# Altium project Power Distribution Board.PrjPcb (part 1 of 2)
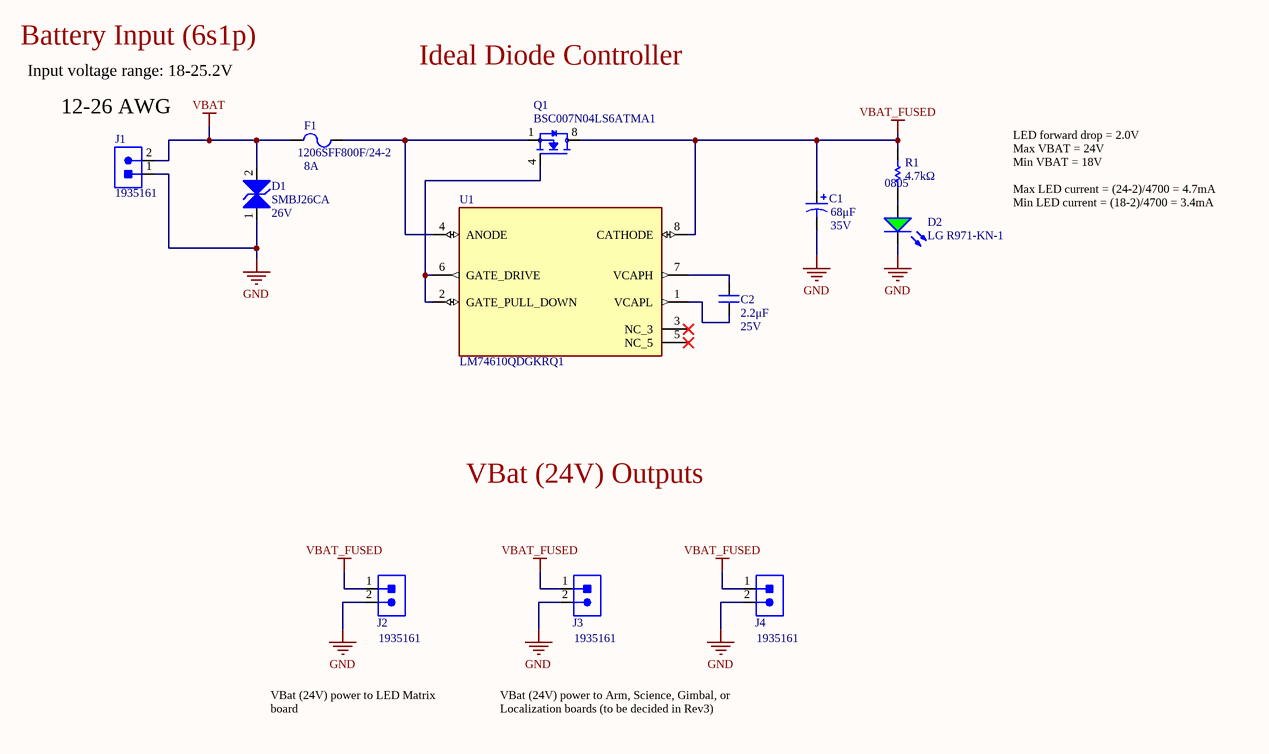
[diagram p0: SH1 - POWER.SchDoc]
10 sheets, 250 parts. Net scope: flat (ports and power ports of the same name join across sheets).
Board file: Power Distribution Board.PcbDoc
Sheets:
  SH1 - POWER.SchDoc
  SH2 - 24V BUCK-BOOST CONVERTER.SchDoc
  SH3 - 17V BUCK CONVERTER.SchDoc
  SH4 - 5V VICOR DCDC.SchDoc
  SH5 - 3.3V LINEAR REGULATOR.SchDoc
  SH6 - LOAD MONITORING 1.SchDoc
  SH7 - LOAD MONITORING 2.SchDoc
  SH8 - MICROCONTROLLER.SchDoc
  SH9 - CAN.SchDoc
  SH10 - RS-485.SchDoc

## Sheet SH1 - POWER.SchDoc: Power
size B; CheckedBy: Lance Bantoto; Engineer: Cindy Li; Organization: UW Robotics; Address1: 200 University Avenue; Address2: Waterloo; Address3: Ontario; Address4: Canada N2L 3G6; DocumentNumber: 1; Revision: 2; SheetNumber: 1; SheetTotal: 10

### Parts
C1  value 68μF  Voltage Rating: 35V  [RADIAL_NICHION_1V]  (hidden comment: CAP_68uF_35V_ALUM)
C2  value 2.2μF  Voltage Rating: 25V  [CAP2012]  (hidden comment: CAP_2.2uF_25V_0805)
D1  Manufacturer Part Number 1: SMBJ26CA  Reverse Standoff Voltage: 26V  [TVS_DIODE_BIDIRECTIONAL]  (hidden comment: TVS_DIODE_BIDIR_26V)
D2  Manufacturer Part Number 1: LG R971-KN-1  [LED_0805_GREEN]  (hidden comment: DIO_LED_G)
F1  Manufacturer Part Number 1: 1206SFF800F/24-2  Current Rating: 8A  [FUSE_1206]  (hidden comment: FUSE_8A_1206)
J1  CON_2M_TERM  [1935161]  (value not drawn)
J2  CON_2M_TERM  [1935161]  (value not drawn)
J3  CON_2M_TERM  [1935161]  (value not drawn)
J4  CON_2M_TERM  [1935161]  (value not drawn)
Q1  Manufacturer Part Number 1: BSC007N04LS6ATMA1  [TRANS_BSC007N04LS6ATMA1]  (hidden comment: NMOS_40V_100A)
R1  value 4.7kΩ  Package/Footprint: 0805  [RESC0805]  (hidden comment: RES_4.7kΩ_0805_5%)
U1  LM74610QDGKRQ1  [SOP65P490X110-8N]

### Nets
GND: C1.2 D1.1 D2.2(K) J1.1 J2.2 J3.2 J4.2
VBAT: D1.2 F1.1 J1.2
VBAT_FUSED: C1.1 J2.1 J3.1 J4.1 Q1.8(D) R1.2 U1.8(CATHODE)
NetC2_1: C2.1 U1.1(VCAPL)
NetC2_2: C2.2 U1.7(VCAPH)
NetD2_1: D2.1(A) R1.1
NetF1_2: F1.2 Q1.1(S) U1.4(ANODE)
NetQ1_4: Q1.4(G) U1.2(GATE_PULL_DOWN) U1.6(GATE_DRIVE)

Not connected (* = marked no-connect by the designer): U1 3(NC_3)* 5(NC_5)*

### Notes on the sheet
- Battery Input (6s1p)
- Input voltage range: 18-25.2V
- Ideal Diode Controller
- (near J1) 12-26 AWG
- LED forward drop = 2.0V
  Max VBAT = 24V
  Min VBAT = 18V
  Max LED current = (24-2)/4700 = 4.7mA
  Min LED current = (18-2)/4700 = 3.4mA
- VBat (24V) Outputs
- VBat (24V) power to LED Matrix board
- VBat (24V) power to Arm, Science, Gimbal, or Localization boards (to be decided in Rev3)
- Title:
- Project:
- Date:
- Rev:
- Reviewer:
- Engineer:
- Sheet:
- of

### Library data of the parts
C1 = CAP_68uF_35V_ALUM: CAP ALUM 68UF 20% 35V SMD; Manufacturer 1: Nichicon; Manufacturer Part Number 1: UUD1V680MCL1GS; ESR (Equivalent Series Resistance): 340mR; Polarity: Polar; Voltage Rating (DC): 50V; Supplier 1: Digi-Key; Min Operating Temperature: -55°C; Max Operating Temperature: 105°C; Tolerance: 20%; Diameter: 6.3mm; Height - Seated (Max): 7.7mm; Supplier Part Number 1: 493-2289-1-ND; Mounting Type: SMD; Package/Footprint: SMD
C2 = CAP_2.2uF_25V_0805: CAP CER 2.2UF 25V X7R 0805; Manufacturer 1: Samsung Electro-Mechanics; Manufacturer Part Number 1: CL21B225KAFNNWE; Package/Footprint: 0805; Supplier 1: Digi-Key; Supplier Part Number 1: 1276-2955-1-ND; LCSC Part #: C49217; Mounting Type: SMD
D1 = TVS_DIODE_BIDIR_26V: TVS DIODE 26V 42.1V DO214AA; Manufacturer 1: Littelfuse; Min Breakdown Voltage: 28.9V; Direction: Bidirectional; Package/Footprint: SMB; Supplier 1: Digi-Key; Clamping Voltage: 42.1V; Supplier Part Number 1: SMBJ26CALFCT-ND; LCSC Part #: C8835; Mounting Type: SMD
D2 = DIO_LED_G: LED GREEN DIFFUSED 0805 SMD; Manufacturer 1: OSRAM; Forward Voltage Drop: 2.2V; Package/Footprint: 0805; Supplier Part Number 1: 475-1410-1-ND; Supplier 1: Digi-Key; Mounting Type: SMD
F1 = FUSE_8A_1206: FUSE SMD 8A 24V; Manufacturer 1: Littelfuse; Package/Footprint: 1206; Supplier 1: Digi-Key; Supplier Part Number 1: 1206SFF800F/24-2CT-ND; LCSC Part #: C311032; Mounting Type: SMD
J1 = CON_2M_TERM: TERM BLK 2POS SIDE ENTRY 5MM; Manufacturer 1: Phoenix Contact; Voltage: 300V; Current: 18A; Max Current Rating: 16A; Package/Footprint: SMD; Supplier 1: Digi-Key; Manufacturer Part Number 1: 1935161; Supplier Part Number 1: 277-1667-ND; Mounting Type: TH
J2-J4 = CON_2M_TERM: TERM BLK 2POS SIDE ENTRY 5MM; Manufacturer 1: Phoenix Contact; Max Current Rating: 16A; Current: 18A; Voltage: 300V; Package/Footprint: SMD; Supplier 1: Digi-Key; Supplier Part Number 1: 277-1667-ND; Manufacturer Part Number 1: 1935161; Mounting Type: TH
Q1 = NMOS_40V_100A: N-Channel 40V 100A 188W Surface Mount PG-TDSON-8-6; Manufacturer 1: Infineon Technologies; Drive Voltage (Max Rds On, Min Rds On): 4.5V, 10V; Rds On (Max) @ Id, Vgs: 0.7mOhm @ 50A, 10V; Vgs (Max): ±20V; Package/Footprint: 8-PowerTDFN; Supplier 1: Digi-Key; Supplier Part Number 1: BSC007N04LS6ATMA1CT-ND; Continuous Drain Current (Id) @ 25°C: 100A; Power Dissipation: 188W; FET Type: N-Channel; Operating Temperature: -55°C ~ 175°C (TJ); Mounting Type: SMD; Drain to Source Voltage (Vdss): 40V; Parameter 1: *
R1 = RES_4.7kΩ_0805_5%: RES 4.7K OHM 5% 1/8W 0805; Manufacturer 1: Yageo; Manufacturer Part Number 1: RC0805JR-074K7L; Supplier 1: Digi-Key; Supplier Part Number 1: 311-4.7KARCT-ND; LCSC Part #: C17673; Mounting Type: SMD
U1 = LM74610QDGKRQ1: IC SMART DIODE CTLR 8VSSOP; Manufacturer 1: Texas Instruments; Supply Voltage (Max): 42V; Package/Footprint: 8-TSSOP; Supplier 1: Digi-Key; Supplier Part Number 1: 296-43067-1-ND; Manufacturer Part Number 1: LM74610QDGKRQ1; LCSC Part #: C202259; Mounting Type: SMD

## Sheet SH2 - 24V BUCK-BOOST CONVERTER.SchDoc: 24V Buck-Boost Converter
size B; CheckedBy: Lance Bantoto; Engineer: Cindy Li; Organization: UW Robotics; Address1: 200 University Avenue; Address2: Waterloo; Address3: Ontario; Address4: Canada N2L 3G6; DocumentNumber: 2; Revision: 2; SheetNumber: 2; SheetTotal: 10
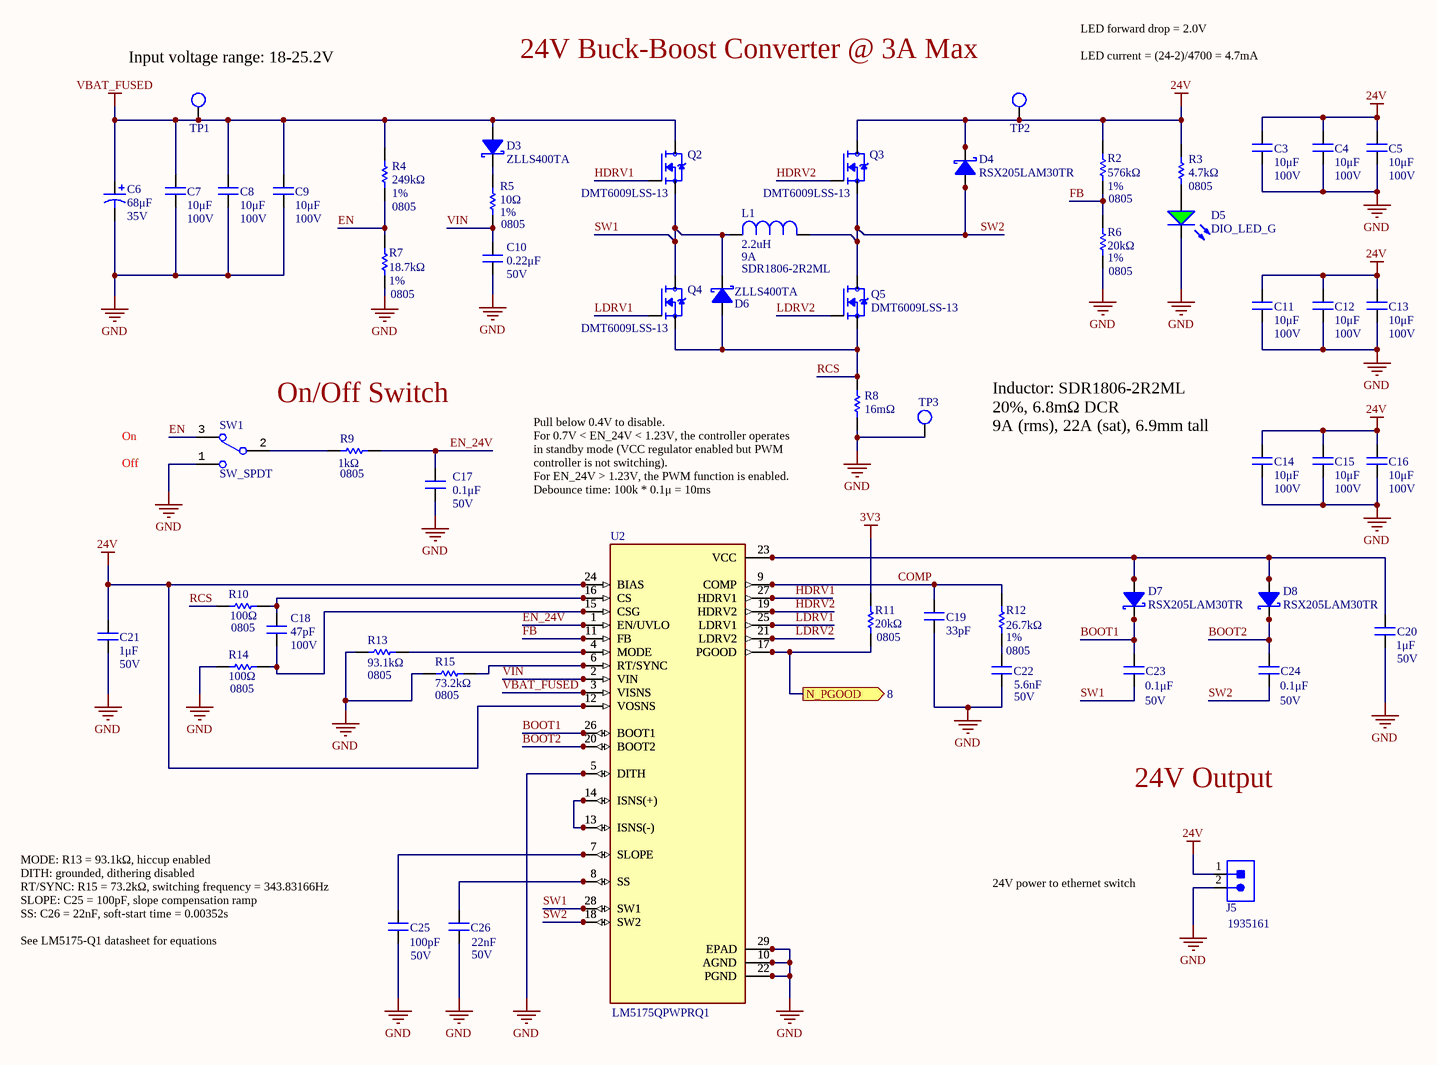
[diagram p1: SH2 - 24V BUCK-BOOST CONVERTER.SchDoc]

### Parts
C3  value 10μF  Voltage Rating: 100V  [CAP1210]  (hidden comment: CAP_10uF_100V_1210)
C4  value 10μF  Voltage Rating: 100V  [CAP1210]  (hidden comment: CAP_10uF_100V_1210)
C5  value 10μF  Voltage Rating: 100V  [CAP1210]  (hidden comment: CAP_10uF_100V_1210)
C6  value 68μF  Voltage Rating: 35V  [RADIAL_NICHION_1V]  (hidden comment: CAP_68uF_35V_ALUM)
C7  value 10μF  Voltage Rating: 100V  [CAP1210]  (hidden comment: CAP_10uF_100V_1210)
C8  value 10μF  Voltage Rating: 100V  [CAP1210]  (hidden comment: CAP_10uF_100V_1210)
C9  value 10μF  Voltage Rating: 100V  [CAP1210]  (hidden comment: CAP_10uF_100V_1210)
C10  value 0.22μF  Voltage Rating: 50V  [CAP2012]  (hidden comment: CAP_0.22uF_50V_0805)
C11  value 10μF  Voltage Rating: 100V  [CAP1210]  (hidden comment: CAP_10uF_100V_1210)
C12  value 10μF  Voltage Rating: 100V  [CAP1210]  (hidden comment: CAP_10uF_100V_1210)
C13  value 10μF  Voltage Rating: 100V  [CAP1210]  (hidden comment: CAP_10uF_100V_1210)
C14  value 10μF  Voltage Rating: 100V  [CAP1210]  (hidden comment: CAP_10uF_100V_1210)
C15  value 10μF  Voltage Rating: 100V  [CAP1210]  (hidden comment: CAP_10uF_100V_1210)
C16  value 10μF  Voltage Rating: 100V  [CAP1210]  (hidden comment: CAP_10uF_100V_1210)
C17  value 0.1μF  Voltage Rating: 50V  [CAP2012]  (hidden comment: CAP_0.1uF_50V_0805)
C18  Voltage Rating: 100V  Capacitance: 47pF  [CAP2012]  (hidden comment: CAP_47pF_100V_0805)
C19  value 33pF  [CAP2012]  (hidden comment: CAP_33pF_50V_0805)
C20  value 1μF  Voltage Rating: 50V  [CAP2012]  (hidden comment: CAP_1uF_50V_0805)
C21  value 1μF  Voltage Rating: 50V  [CAP2012]  (hidden comment: CAP_1uF_50V_0805)
C22  Capacitance: 5.6nF  Voltage Rating: 50V  [CAP2012]  (hidden comment: CAP_5600pF_50V_0805)
C23  value 0.1μF  Voltage Rating: 50V  [CAP2012]  (hidden comment: CAP_0.1uF_50V_0805)
C24  value 0.1μF  Voltage Rating: 50V  [CAP2012]  (hidden comment: CAP_0.1uF_50V_0805)
C25  value 100pF  Voltage Rating: 50V  [CAP2012]  (hidden comment: CAP_100pF_50V_0805)
C26  value 22nF  Voltage Rating: 50V  [CAP2012]  (hidden comment: CAP_0.022uF_50V_0805)
D3  Manufacturer Part Number 1: ZLLS400TA  [SOD-323]  (hidden comment: DIO_SCHOTTKY_40V_520mA)
D4  Manufacturer Part Number 1: RSX205LAM30TR  [SOD-128]  (hidden comment: DIO_SCHOTTKY_30V_2A)
D5  DIO_LED_G  [LED_0805_GREEN]
D6  Manufacturer Part Number 1: ZLLS400TA  [SOD-323]  (hidden comment: DIO_SCHOTTKY_40V_520mA)
D7  Manufacturer Part Number 1: RSX205LAM30TR  [SOD-128]  (hidden comment: DIO_SCHOTTKY_30V_2A)
D8  Manufacturer Part Number 1: RSX205LAM30TR  [SOD-128]  (hidden comment: DIO_SCHOTTKY_30V_2A)
J5  CON_2M_TERM  [1935161]  (value not drawn)
L1  Current Rating: 9A  Manufacturer Part Number 1: SDR1806-2R2ML  Inductance: 2.2uH  [IND_BOURNS_SDR1806]  (hidden comment: IND_2.2uH_9A)
Q2  Manufacturer Part Number 1: DMT6009LSS-13  [TRANS_DMP2002UPS-13]  (hidden comment: NMOS_60V_10.8A)
Q3  Manufacturer Part Number 1: DMT6009LSS-13  [TRANS_DMP2002UPS-13]  (hidden comment: NMOS_60V_10.8A)
Q4  Manufacturer Part Number 1: DMT6009LSS-13  [TRANS_DMP2002UPS-13]  (hidden comment: NMOS_60V_10.8A)
Q5  Manufacturer Part Number 1: DMT6009LSS-13  [TRANS_DMP2002UPS-13]  (hidden comment: NMOS_60V_10.8A)
R2  value 576kΩ  Tolerance: 1%  Package/Footprint: 0805  [RESC0805]  (hidden comment: RES_576kΩ_0805_1%)
R3  value 4.7kΩ  Package/Footprint: 0805  [RESC0805]  (hidden comment: RES_4.7kΩ_0805_5%)
R4  value 249kΩ  Tolerance: 1%  Package/Footprint: 0805  [RESC0805]  (hidden comment: RES_249kΩ_0805_1%)
R5  value 10Ω  Tolerance: 1%  Package/Footprint: 0805  [RESC0805]  (hidden comment: RES_10Ω_0805_1%)
R6  value 20kΩ  Tolerance: 1%  Package/Footprint: 0805  [RESC0805]  (hidden comment: RES_20kΩ_0805_1%)
R7  value 18.7kΩ  Tolerance: 1%  Package/Footprint: 0805  [RESC0805]  (hidden comment: RES_18.7kΩ_0805_1%)
R8  value 16mΩ  [RESC1632X60N]  (hidden comment: RES_16mΩ_1206_1%)
R9  Resistance: 1kΩ  Package/Footprint: 0805  [RESC0805]  (hidden comment: RES_1kΩ_0805_1%)
R10  value 100Ω  Package/Footprint: 0805  [RESC0805]  (hidden comment: RES_100Ω_0805_1%)
R11  value 20kΩ  Package/Footprint: 0805  [RESC0805]  (hidden comment: RES_20kΩ_0805_1%)
R12  value 26.7kΩ  Tolerance: 1%  Package/Footprint: 0805  [RESC0805]  (hidden comment: RES_26.7kΩ_0805_1%)
R13  value 93.1kΩ  Package/Footprint: 0805  [RESC0805]  (hidden comment: RES_93.1kΩ_0805_1%)
R14  value 100Ω  Package/Footprint: 0805  [RESC0805]  (hidden comment: RES_100Ω_0805_1%)
R15  value 73.2kΩ  Package/Footprint: 0805  [RESC0805]  (hidden comment: RES_73.2kΩ_0805_1%)
SW1  SW_SPDT  [100SP1T1B4M2QE]
TP1  TESTPOINT_LOOP  [TESTPOINT_LOOP]  (value not drawn)
TP2  TESTPOINT_LOOP  [TESTPOINT_LOOP]  (value not drawn)
TP3  TESTPOINT_LOOP  [TESTPOINT_LOOP]  (value not drawn)
U2  Manufacturer Part Number 1: LM5175QPWPRQ1  [IC_TPS61196PWPRQ1]  (hidden comment: LM5175PWPR)

### Ports
N_PGOOD (out, see 8)

### Nets
3V3: R11.2
24V: C3.1 C4.1 C5.2 C11.1 C12.1 C13.2 C14.1 C15.1 C16.2 C21.2 D4.2(Cathode) J5.1 Q3.1(D) R2.2 R3.2 TP2.1 U2.12(VOSNS) U2.24(BIAS)
GND: C3.2 C4.2 C5.1 C6.2 C7.1 C8.1 C9.1 C10.1 C11.2 C12.2 C13.1 C14.2 C15.2 C16.1 C17.1 C19.1 C20.1 C21.1 C22.1 C25.1 C26.1 D5.2(K) J5.2 R6.1 R7.1 R8.1 R13.1 R14.1 R15.1 SW1.1 TP3.1 U2.5(DITH) U2.10(AGND) U2.22(PGND) U2.29(EPAD)
VBAT_FUSED: C6.1 C7.2 C8.2 C9.2 D3.1(Anode) Q2.1(D) R4.2 TP1.1 U2.3(VISNS)
BOOT1: C23.2 D7.2(Cathode) U2.26(BOOT1)
BOOT2: C24.2 D8.2(Cathode) U2.20(BOOT2)
COMP: C19.2 R12.2 U2.9(COMP)
EN: R4.1 R7.2 SW1.3
EN_24V: C17.2 R9.2 U2.1(EN/UVLO)
FB: R2.1 R6.2 U2.11(FB)
HDRV1: Q2.3(G) U2.27(HDRV1)
HDRV2: Q3.3(G) U2.19(HDRV2)
LDRV1: Q4.3(G) U2.25(LDRV1)
LDRV2: Q5.3(G) U2.21(LDRV2)
RCS: D6.1(Anode) Q4.2(S) Q5.2(S) R8.2 R10.1
SW1: C23.1 D6.2(Cathode) L1.2 Q2.2(S) Q4.1(D) U2.28(SW1)
SW2: C24.1 D4.1(Anode) L1.1 Q3.2(S) Q5.1(D) U2.18(SW2)
VIN: C10.2 R5.1 U2.2(VIN)
NetC18_1: C18.1 R10.2 U2.16(CS)
NetC18_2: C18.2 R14.2 U2.15(CSG)
NetC20_2: C20.2 D7.1(Anode) D8.1(Anode) U2.23(VCC)
NetC22_2: C22.2 R12.1
NetC25_2: C25.2 U2.7(SLOPE)
NetC26_2: C26.2 U2.8(SS)
NetD3_2: D3.2(Cathode) R5.2
NetD5_1: D5.1(A) R3.1
NetR9_1: R9.1 SW1.2
NetR11_1: R11.1 U2.17(PGOOD) ; port N_PGOOD
NetR13_2: R13.2 U2.4(MODE)
NetR15_2: R15.2 U2.6(RT/SYNC)
NetU2_13: U2.13(ISNS(-)) U2.14(ISNS(+))

### Notes on the sheet
- (near TP1) Input voltage range: 18-25.2V
- (near TP2) 24V Buck-Boost Converter @ 3A Max
- LED forward drop = 2.0V
  LED current = (24-2)/4700 = 4.7mA
- On
- On/Off Switch
- (near C14) Inductor: SDR1806-2R2ML
  20%, 6.8mΩ DCR
  9A (rms), 22A (sat), 6.9mm tall
- Off
- Pull below 0.4V to disable.
  For 0.7V < EN_24V < 1.23V, the controller operates in standby mode (VCC regulator enabled but PWM controller is not switching).
  For EN_24V > 1.23V, the PWM function is enabled.
  Debounce time: 100k * 0.1μ = 10ms
- 24V Output
- 24V power to ethernet switch
- (near C25) MODE: R13 = 93.1kΩ, hiccup enabled
  DITH: grounded, dithering disabled
  RT/SYNC: R15 = 73.2kΩ, switching frequency = 343.83166Hz
  SLOPE: C25 = 100pF, slope compensation ramp
  SS: C26 = 22nF, soft-start time = 0.00352s
  See LM5175-Q1 datasheet for equations
- Title:
- Project:
- Date:
- Rev:
- Reviewer:
- Engineer:
- Sheet:
- of

### Library data of the parts
C3-C5 C7-C9 C11-C16 = CAP_10uF_100V_1210: CAP CER 10uF 100V X7S 10% 1210; Manufacturer 1: Murata; Manufacturer Part Number 1: GRM32EC72A106KE05L; Package/Footprint: 1210; Tolerance: 10%; Dielectric: X7S; Supplier 1: Digi-Key; Supplier Part Number 1: 490-16266-1-ND; Mounting Type: SMD
C6 = CAP_68uF_35V_ALUM: as C1 on sheet SH1 - POWER; Supplier 1: Digi-Key; Min Operating Temperature: -55°C; Max Operating Temperature: 105°C; Tolerance: 20%; Diameter: 6.3mm; Height - Seated (Max): 7.7mm; Supplier Part Number 1: 493-2289-1-ND; Mounting Type: SMD; Package/Footprint: SMD
C10 = CAP_0.22uF_50V_0805: CAP CER 0.22UF 50V X7R 0805; Manufacturer Part Number 1: C0805C224K5RACTU; Manufacturer 1: KEMET; Package/Footprint: 0805; Supplier Part Number 1: 399-3491-1-ND; Supplier 1: Digi-Key; Dielectric: X7R; LCSC Part #: C5378; Mounting Type: SMD
C17 = CAP_0.1uF_50V_0805: CAP CER 0.1UF 50V X7R 0805; Manufacturer Part Number 1: GCM21BR71H104KA37K; Manufacturer 1: Murata Electronics; Tolerance: 10%; Package/Footprint: 0805; Supplier Part Number 1: 490-8049-1-ND; Supplier 1: Digi-Key; Mount: Surface Mount; Dielectric: X7R; Length: 2mm; Height: 1.25mm; Width: 0.049inch; Thickness: 0.049inch; Depth: 1.25mm; Ratings: AEC-Q200; LCSC Part #: C49678; Mounting Type: SMD
C18 = CAP_47pF_100V_0805: CAP CER 47PF 100V NPO 0805; Manufacturer Part Number 1: AC0805JRNPO0BN470; Manufacturer 1: Yageo; Package/Footprint: 0805; Supplier Part Number 1: 311-3131-1-ND; Supplier 1: Digi-Key; Mounting Type: SMD
C19 = CAP_33pF_50V_0805: CAP CER 33PF 50V C0G/NP0 0805; Manufacturer 1: Samsung Electro-Mechanics; Manufacturer Part Number 1: CL21C330JBANNNC; Package/Footprint: 0805; Mount: Surface Mount; Dielectric: C0G/NP0; Supplier 1: Digi-Key; Supplier Part Number 1: 1276-1105-1-ND; Mounting Type: SMD
C20 C21 = CAP_1uF_50V_0805: CAP CER 1UF 50V X7R 0805; Manufacturer Part Number 1: CL21B105KBFNNNG; Manufacturer 1: Samsung Electro-Mechanics; Tolerane: ±10%; Package/Footprint: 0805; Temperature Coefficient: X7R; Supplier Part Number 1: 1276-6470-1-ND; Supplier 1: Digi-Key; LCSC Part #: C28323; Mounting Type: SMD
C22 = CAP_5600pF_50V_0805: CAP CER 5600PF 50V C0G 0805; Manufacturer 1: TDK Corporation; Manufacturer Part Number 1: CGA4C2C0G1H562J060AA; Tolerance: 5%; Package/Footprint: 0805; Voltage Rating (DC): 50V; Supplier 1: Digi-Key; Supplier Part Number 1: 445-6944-1-ND; Dielectric: C0G; Mounting Type: SMD
C23 C24 = CAP_0.1uF_50V_0805: CAP CER 0.1UF 50V X7R 0805; Manufacturer 1: Murata Electronics; Manufacturer Part Number 1: GCM21BR71H104KA37K; Tolerance: 10%; Package/Footprint: 0805; Mount: Surface Mount; Length: 2mm; Height: 1.25mm; Width: 0.049inch; Thickness: 0.049inch; Depth: 1.25mm; Ratings: AEC-Q200; Supplier 1: Digi-Key; Supplier Part Number 1: 490-8049-1-ND; Dielectric: X7R; LCSC Part #: C49678; Mounting Type: SMD
C25 = CAP_100pF_50V_0805: CAP CER 100PF 50V C0G/NP0 0805; Manufacturer Part Number 1: C0805C101J5GACTU; Manufacturer 1: KEMET; Dielectric: C0G, NP0; Package/Footprint: 0805; Supplier Part Number 1: 399-1122-1-ND; Supplier 1: Digi-Key; Mounting Type: SMD
C26 = CAP_0.022uF_50V_0805: CAP CER 0.022UF 50V C0G 0805; Manufacturer 1: TDK Corporation; Manufacturer Part Number 1: CGA4J2C0G1H223J125AA; Package/Footprint: 2012; Supplier 1: Digi-Key; Supplier Part Number 1: 445-6949-1-ND; Dielectric: C0G; LCSC Part #: C1729; Mounting Type: SMD
D3 D6 = DIO_SCHOTTKY_40V_520mA: DIODE SCHOTTKY 40V 520MA SOD323; Manufacturer 1: Diodes Incorporated; Supplier 1: Digi-Key; Supplier Part Number 1: ZLLS400TACT-ND; Vr (Max): 40V; Io: 520mA; Mounting Type: SMD; Package/Footprint: SOD-323
D4 D7 D8 = DIO_SCHOTTKY_30V_2A: DIODE SCHOTTKY 30V 2A PMDTM; Manufacturer 1: Rohm Semiconductor; Vf (Max): 490mV; Supplier 1: Digi-Key; Supplier Part Number 1: RSX205LAM30CT-ND; Vr (Max): 30V; Io: 2A; Mounting Type: SMD; Package/Footprint: SOD-128
D5 = DIO_LED_G: LED GREEN DIFFUSED 0805 SMD; Manufacturer Part Number 1: LG R971-KN-1; Manufacturer 1: OSRAM; Forward Voltage Drop: 2.2V; Package/Footprint: 0805; Supplier Part Number 1: 475-1410-1-ND; Supplier 1: Digi-Key; Mounting Type: SMD
J5 = CON_2M_TERM: as J2 on sheet SH1 - POWER; Supplier 1: Digi-Key; Supplier Part Number 1: 277-1667-ND; Manufacturer Part Number 1: 1935161; Mounting Type: TH
L1 = IND_2.2uH_9A: FIXED IND 2.2UH 9A 6.8 MOHM SMD; Manufacturer 1: Bourns; Core Material: Ferrite; Tolerance: 20%; Supplier 1: Digi-Key; Category: Fixed Inductors; Number of Pins: 2; Min Operating Temperature: -40°C; Max Operating Temperature: 125°C; DC Resistance (DCR): 6.8mOhm; Termination: SMD/SMT; Composition: Wirewound; Height - Seated (Max): 0.272"" (6.90mm); Supplier Part Number 1: SDR1806-2R2MLCT-ND; Size / Dimension: 0.720"" L x 0.551"" W (18.30mm x 14.00mm); Mounting Type: SMD; Package/Footprint: SMD
Q2-Q5 = NMOS_60V_10.8A: MOSFET BVDSS: 41V 60V,SO-8,T&R,2; Manufacturer 1: Texas Instruments; Continuous Drain Current (Id) @ 25°C: 10.8A (Ta); Drive Voltage (Max Rds On, Min Rds On): 4.5V, 10V; Rds On (Max) @ Id, Vgs: 59mOhm @ 5A, 10V; Vgs(th) (Max) @ Id: 9.5mOhm @ 13.5A, 10V; Vgs (Max): ±20V; Power Dissipation (Max): 1.25W (Ta); Package/Footprint: 8-SOIC; Supplier 1: Digi-Key; Supplier Part Number 1: DMT6009LSS-13DICT-ND; Operating Temperature: -55°C - 150°C (TJ); Mounting Type: SMD; Drain to Source Voltage (Vdss): 60V; LCSC Part #: C508211
R2 = RES_576kΩ_0805_1%: RES 576K OHM 1% 1/8W 0805; Manufacturer 1: Panasonic Electronic Components; Manufacturer Part Number 1: ERJ-6ENF5763V; Supplier Part Number 1: P576KCCT-ND; Supplier 1: Digi-Key; LCSC Part #: C17760; Mounting Type: SMD
R3 = RES_4.7kΩ_0805_5%: as R1 on sheet SH1 - POWER; Supplier 1: Digi-Key; Supplier Part Number 1: 311-4.7KARCT-ND; LCSC Part #: C17673; Mounting Type: SMD
R4 = RES_249kΩ_0805_1%: RES 249K OHM 1% 1/8W 0805; Manufacturer 1: Yageo; Manufacturer Part Number 1: RC0805FR-07249KL; Supplier Part Number 1: 311-249KCRCT-ND; Supplier 1: Digi-Key; LCSC Part #: C25825; Mounting Type: SMD
R5 = RES_10Ω_0805_1%: RES 10 OHM 1% 1/8W 0805; Manufacturer 1: Yageo; Manufacturer Part Number 1: RC0805FR-0710RL; Supplier Part Number 1: 311-10.0CRCT-ND; Supplier 1: Digi-Key; LCSC Part #: C17415; Mounting Type: SMD
R6 R11 = RES_20kΩ_0805_1%: RES 20K OHM 1% 1/8W 0805; Manufacturer 1: Yageo; Manufacturer Part Number 1: RC0805FR-0720KL; Supplier Part Number 1: 311-20.0KCRCT-ND; Supplier 1: Digi-Key; LCSC Part #: C4328; Mounting Type: SMD
  R11: Tolerance: 1%
R7 = RES_18.7kΩ_0805_1%: RES 18.7K OHM 1% 1/8W 0805 /; Manufacturer 1: Yageo; Manufacturer Part Number 1: RC0805FR-0718K7L; Supplier Part Number 1: 311-18.7KCRCT-ND; Supplier 1: Digi-Key; LCSC Part #: C17499; Mounting Type: SMD
R8 = RES_16mΩ_1206_1%: RES 0.016 OHM 1W 1206 WIDE; Manufacturer 1: Susumu; Manufacturer Part Number 1: PRL1632-R016-F-T1; Tolerance: 1%; Package/Footprint: 1206; Supplier Part Number 1: PRL1632.016FCT-ND; Supplier 1: Digi-Key; Mounting Type: SMD
R9 = RES_1kΩ_0805_1%: RES 1K OHM 1% 1/8W 0805; Manufacturer 1: Yageo; Manufacturer Part Number 1: RC0805FR-071KL; Supplier Part Number 1: 311-1.00KCRCT-ND; Supplier 1: Digi-Key; Tolerance: 1%; LCSC Part #: C17513; Mounting Type: SMD
R10 R14 = RES_100Ω_0805_1%: RES 100 OHM 1% 1/8W 0805; Manufacturer 1: Vishay Dale; Manufacturer Part Number 1: CRCW0805100RFKEA; Supplier Part Number 1: 541-100CCT-ND; Supplier 1: Digi-Key; LCSC Part #: C1790; Mounting Type: SMD
R12 = RES_26.7kΩ_0805_1%: RES 26.7K OHM 1% 1/8W 0805; Manufacturer 1: Panasonic Electronic Components; Manufacturer Part Number 1: ERJ-6ENF2672V; Supplier Part Number 1: P26.7KCCT-ND; Supplier 1: Digi-Key; LCSC Part #: C17581; Mounting Type: SMD
R13 = RES_93.1kΩ_0805_1%: RES 93.1K OHM 1% 1/8W 0805; Manufacturer 1: Panasonic Electronic Components; Manufacturer Part Number 1: ERJ-6ENF9312V; Supplier Part Number 1: P93.1KCCT-ND; Supplier 1: Digi-Key; Tolerance: 1%; LCSC Part #: C17869; Mounting Type: SMD
R15 = RES_73.2kΩ_0805_1%: RES 73.2K OHM 1% 1/8W 0805 /; Manufacturer 1: Panasonic Electronic Components; Manufacturer Part Number 1: ERJ-6ENF7322V; Supplier Part Number 1: P73.2KCCT-ND; Supplier 1: Digi-Key; Tolerance: 1%; LCSC Part #: C17814; Mounting Type: SMD
SW1 = SW_SPDT: SWITCH TOGGLE SPDT 5A 120V; Manufacturer 1: E-Switch; Voltage Rating (DC): 28V; Package/Footprint: TH; Supplier 1: Digi-Key; Manufacturer Part Number 1: 100SP1T1B4M2QE; Throw Configuration: SPDT; Supplier Part Number 1: EG2355-ND; Current Rating: 5A; Mounting Type: TH
TP1-TP3 = TESTPOINT_LOOP: PC TEST POINT MINIATURE WHITE; Manufacturer 1: Keystone Electronics; Manufacturer Part Number 1: 5002; Package/Footprint: TH; Supplier 1: Digi-Key; Supplier Part Number 1: 36-5002-ND; Mounting Type: TH
U2 = LM5175PWPR: IC REG CTRLR BUCK-BOOST 28HTSSOP; Manufacturer 1: Texas Instruments; Supply Voltage: 3.5V - 42V; Switching Frequency: 100kHz - 600kHz; Synchronous Rectifier: Yes; Control Features: Enable, Frequency Control, Power Good, Soft Start; Number of Outputs: 1; Package/Footprint: 28-PowerTSSOP; Supplier 1: Digi-Key; Supplier Part Number 1: 296-44175-1-ND; Clock Sync: Yes; Operating Temperature: -40°C - 150°C (TJ); Mounting Type: SMD; LCSC Part #: C113356

## Sheet SH3 - 17V BUCK CONVERTER.SchDoc: 17V Buck Converter
size B; CheckedBy: Lance Bantoto; Engineer: Cindy Li; Organization: UW Robotics; Address1: 200 University Avenue; Address2: Waterloo; Address3: Ontario; Address4: Canada N2L 3G6; DocumentNumber: 3; Revision: 2; SheetNumber: 3; SheetTotal: 10
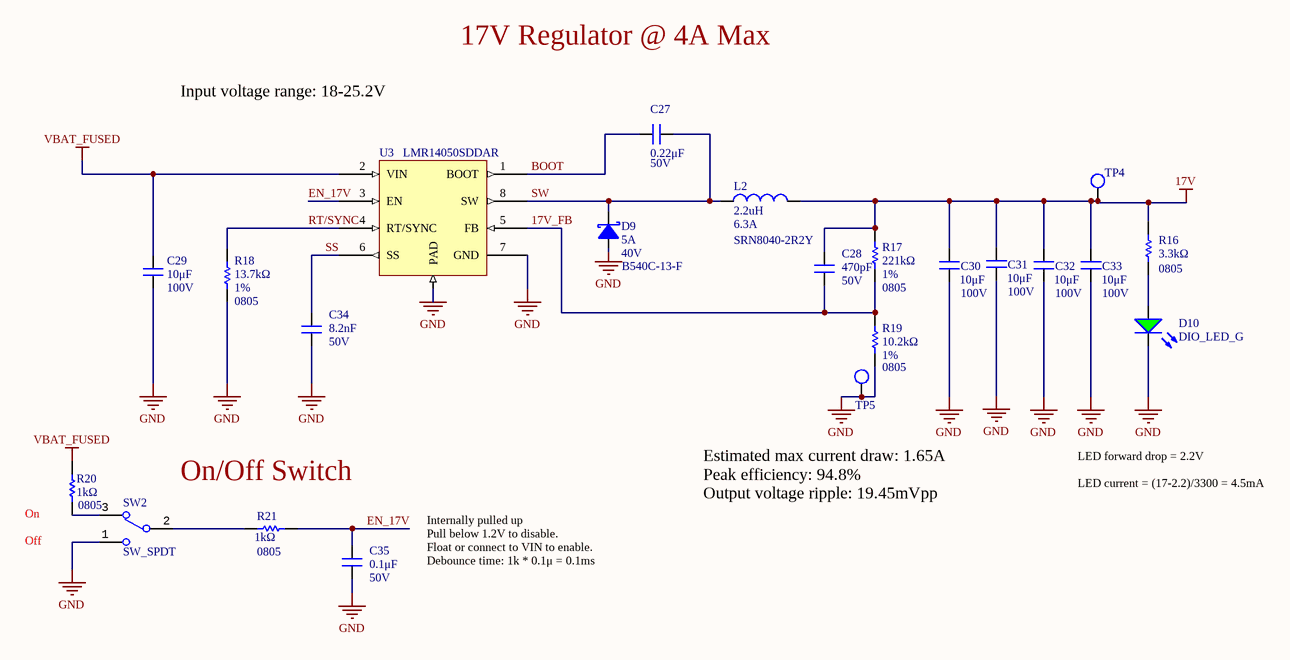
[diagram p2: SH3 - 17V BUCK CONVERTER.SchDoc]

### Parts
C27  value 0.22μF  Voltage Rating: 50V  [CAP2012]  (hidden comment: CAP_0.22uF_50V_0805)
C28  Voltage Rating: 50V  Capacitance: 470pF  [CAP2012]  (hidden comment: CAP_470pF_50V_0805)
C29  value 10μF  Voltage Rating: 100V  [CAP1210]  (hidden comment: CAP_10uF_100V_1210)
C30  value 10μF  Voltage Rating: 100V  [CAP1210]  (hidden comment: CAP_10uF_100V_1210)
C31  value 10μF  Voltage Rating: 100V  [CAP1210]  (hidden comment: CAP_10uF_100V_1210)
C32  value 10μF  Voltage Rating: 100V  [CAP1210]  (hidden comment: CAP_10uF_100V_1210)
C33  value 10μF  Voltage Rating: 100V  [CAP1210]  (hidden comment: CAP_10uF_100V_1210)
C34  Voltage Rating: 50V  Capacitance: 8.2nF  [CAP2012]  (hidden comment: CAP_8200pF_50V_0805)
C35  value 0.1μF  Voltage Rating: 50V  [CAP2012]  (hidden comment: CAP_0.1uF_50V_0805)
D9  Forward Current: 5A  Voltage: 40V  [DO214AB SMC]  (hidden comment: B540C-13-F)
D10  DIO_LED_G  [LED_0805_GREEN]
L2  Inductance: 2.2uH  Max DC Current: 6.3A  [IND_BOURNS_SRN80]  (hidden comment: SRN8040-2R2Y)
R16  Resistance: 3.3kΩ  Package/Footprint: 0805  [RESC0805]  (hidden comment: RES_3.3kΩ_0805_1%)
R17  Tolerance: 1%  Resistance: 221kΩ  Package/Footprint: 0805  [RESC0805]  (hidden comment: RES_221kΩ_0805_1%)
R18  Tolerance: 1%  Resistance: 13.7kΩ  Package/Footprint: 0805  [RESC0805]  (hidden comment: RES_13.7kΩ_0805_1%)
R19  Tolerance: 1%  Resistance: 10.2kΩ  Package/Footprint: 0805  [RESC2012X60N]  (hidden comment: RES_10.2kΩ_0805_1%)
R20  Resistance: 1kΩ  Package/Footprint: 0805  [RESC0805]  (hidden comment: RES_1kΩ_0805_1%)
R21  Resistance: 1kΩ  Package/Footprint: 0805  [RESC0805]  (hidden comment: RES_1kΩ_0805_1%)
SW2  SW_SPDT  [100SP1T1B4M2QE]
TP4  TESTPOINT_LOOP  [TESTPOINT_LOOP]  (value not drawn)
TP5  TESTPOINT_LOOP  [TESTPOINT_LOOP]  (value not drawn)
U3  LMR14050SDDAR  [8-PowerSOIC]

### Nets
17V: C28.2 C30.2 C31.2 C32.2 C33.2 L2.2 R16.2 R17.2 TP4.1
GND: C29.2 C30.1 C31.1 C32.1 C33.1 C34.1 C35.1 D9.1(Anode) D10.2(K) R18.1 R19.1 SW2.1 TP5.1 U3.7(GND) U3.9(PAD)
VBAT_FUSED: C29.1 R20.2 U3.2(VIN)
17V_FB: C28.1 R17.1 R19.2 U3.5(FB)
BOOT: C27.2 U3.1(BOOT)
EN_17V: C35.2 R21.2 U3.3(EN)
RT/SYNC: R18.2 U3.4(RT/SYNC)
SS: C34.2 U3.6(SS)
SW: C27.1 D9.2(Cathode) L2.1 U3.8(SW)
NetD10_1: D10.1(A) R16.1
NetR20_1: R20.1 SW2.3
NetR21_1: R21.1 SW2.2

### Notes on the sheet
- 17V Regulator @ 4A Max
- Input voltage range: 18-25.2V
- (near R20) On
- On/Off Switch
- Estimated max current draw: 1.65A
  Peak efficiency: 94.8%
  Output voltage ripple: 19.45mVpp
- LED forward drop = 2.2V
  LED current = (17-2.2)/3300 = 4.5mA
- (near R20) Off
- Internally pulled up
  Pull below 1.2V to disable.
  Float or connect to VIN to enable.
  Debounce time: 1k * 0.1μ = 0.1ms
- Title:
- Project:
- Date:
- Rev:
- Reviewer:
- Engineer:
- Sheet:
- of

### Library data of the parts
C27 = CAP_0.22uF_50V_0805: CAP CER 0.22UF 50V X7R 0805; Manufacturer 1: KEMET; Manufacturer Part Number 1: C0805C224K5RACTU; Package/Footprint: 0805; Dielectric: X7R; Supplier 1: Digi-Key; Supplier Part Number 1: 399-3491-1-ND; LCSC Part #: C5378; Mounting Type: SMD
C28 = CAP_470pF_50V_0805: CAP CER 470PF 50V X7R 0805; Manufacturer 1: Kyocera AVX; Manufacturer Part Number 1: 08055C471JAT2A; Package/Footprint: 0805; Supplier 1: Digi-Key; Dielectric: X7R; Supplier Part Number 1: 478-7958-1-ND; Mounting Type: SMD
C29-C33 = CAP_10uF_100V_1210: as C3 on sheet SH2 - 24V BUCK-BOOST CONVERTER; Supplier 1: Digi-Key; Tolerance: 10%; Dielectric: X7S; Supplier Part Number 1: 490-16266-1-ND; Mounting Type: SMD
C34 = CAP_8200pF_50V_0805: CAP CER 8200PF 50V X7R 0805; Package/Footprint: 0805; Dielectric: X7R; Supplier 1: Digi-Key; Supplier Part Number 1: 478-9924-6-ND; Mounting Type: SMD
C35 = CAP_0.1uF_50V_0805: as C17 on sheet SH2 - 24V BUCK-BOOST CONVERTER; Supplier Part Number 1: 490-8049-1-ND; Supplier 1: Digi-Key; Mount: Surface Mount; Dielectric: X7R; Length: 2mm; Height: 1.25mm; Width: 0.049inch; Thickness: 0.049inch; Depth: 1.25mm; Ratings: AEC-Q200; LCSC Part #: C49678; Mounting Type: SMD
D9 = B540C-13-F: DIODE SCHOTTKY 40V 5A SMC; Manufacturer 1: Diodes; Element Configuration: Single; Peak Reverse Current: 500uA; Peak Non-Repetitive Surge Current: 100A; Forward Voltage: 550mV; Capacitance: 300pF; Supplier 1: Digi-Key; Manufacturer Part Number 1: B540C-13-F; Max Operating Temperature: 125°C; Max Repetitive Reverse Voltage (Vrrm): 40V; Max Forward Surge Current (Ifsm): 100A; Average Rectified Current: 5A; Voltage Rating (DC): 40V; Current Rating: 5A; Max Reverse Voltage (DC): 40V; Current: 5A; Supplier Part Number 1: B540C-FDIDKR-ND; LCSC Part #: C72264; Mounting Type: SMD; Package/Footprint: SMC
D10 = DIO_LED_G: as D5 on sheet SH2 - 24V BUCK-BOOST CONVERTER; Supplier Part Number 1: 475-1410-1-ND; Supplier 1: Digi-Key; Mounting Type: SMD
L2 = SRN8040-2R2Y: FIXED IND 2.2UH 6.3A 13 MOHM SMD; Manufacturer 1: Bourns; Core Material: Ferrite; Material: Steel; DC Resistance (DCR): 13mR; Tolerance: 30%; Self Resonant Frequency: 40MHz; Test Frequency: 100kHz; Shielding: Shielded; Saturation Current: 7.4A; Supplier 1: Digi-Key; Manufacturer Part Number 1: SRN8040-2R2Y; Number of Pins: 2; Weight: 0.028607oz; Contact Plating: Tin; Min Operating Temperature: -40°C; Max Operating Temperature: 125°C; Termination: SMD/SMT; Composition: Wirewound; DC Current: 6.3A; Military Standard: Not; RMS Current (Irms): 6.3A; Inductance Tolerance: 30%; Current Rating: 6.3A; Length: 8mm; Height: 4mm; Height - Seated (Max): 0.157inch; Depth: 8.3mm; Width: 8mm; REACH SVHC: No SVHC; ComponentLink7URL: https://datasheet.ciiva.com/1049/srn8040-1049455.pdf?src-supplier=Digi-Key; ComponentLink7Description: https://datasheet.ciiva.com/1049/srn8040-1049455.pdf?src-supplier=Digi-Key; ComponentLink8URL: https://datasheet.ciiva.com/17284/srn8040-17284783.pdf?src-supplier=Avnet+Europe; ComponentLink8Description: https://datasheet.ciiva.com/17284/srn8040-17284783.pdf?src-supplier=Avnet+Europe; ComponentLink9URL: https://datasheet.ciiva.com/48691/001056460-da-01-en-mag-abg-leist-ind-srn8040-2r2y-2-2uh-smd-48691836.pdf?src-supplier=Conrad; ComponentLink9Description: https://datasheet.ciiva.com/48691/001056460-da-01-en-mag-abg-leist-ind-srn8040-2r2y-2-2uh-smd-48691836.pdf?src-supplier=Conrad; Supplier Part Number 1: SRN8040-2R2YCT-ND; Mounting Type: SMD; Package/Footprint: SMD
R16 = RES_3.3kΩ_0805_1%: RES 3.3K OHM 1% 1/8W 0805; Manufacturer 1: Vishay Dale; Manufacturer Part Number 1: CRCW06033K30FKEA; Supplier 1: Digi-Key; Tolerance: 1%; Supplier Part Number 1: 541-3.30KHCT-ND; LCSC Part #: C26010; Mounting Type: SMD
R17 = RES_221kΩ_0805_1%: RES 221K OHM 1% 1/8W 0805; Manufacturer 1: Vishay; Manufacturer Part Number 1: CRCW0805221KFKEA; Supplier 1: Digi-Key; Supplier Part Number 1: 541-221KCCT-ND; LCSC Part #: C75431; Mounting Type: SMD
R18 = RES_13.7kΩ_0805_1%: RES 13.7K OHM 1% 1/8W 0805; Manufacturer 1: Vishay; Manufacturer Part Number 1: CRCW080513K7FKEA; Supplier 1: Digi-Key; Supplier Part Number 1: 541-13.7KCCT-ND; LCSC Part #: C17448; Mounting Type: SMD
R19 = RES_10.2kΩ_0805_1%: RES 10.2K OHM 1% 1/8W 0805; Manufacturer 1: Vishay; Manufacturer Part Number 1: CRCW080510K2FKEA; Supplier 1: Digi-Key; Supplier Part Number 1: 541-10.2KCCT-ND; LCSC Part #: C17402; Mounting Type: SMD
R20 R21 = RES_1kΩ_0805_1%: as R9 on sheet SH2 - 24V BUCK-BOOST CONVERTER; Supplier 1: Digi-Key; Tolerance: 1%; Supplier Part Number 1: 311-1.00KCRCT-ND; LCSC Part #: C17513; Mounting Type: SMD
SW2 = SW_SPDT: as SW1 on sheet SH2 - 24V BUCK-BOOST CONVERTER; Supplier 1: Digi-Key; Manufacturer Part Number 1: 100SP1T1B4M2QE; Throw Configuration: SPDT; Supplier Part Number 1: EG2355-ND; Current Rating: 5A; Mounting Type: TH
TP4 TP5 = TESTPOINT_LOOP: as TP1 on sheet SH2 - 24V BUCK-BOOST CONVERTER; Supplier 1: Digi-Key; Supplier Part Number 1: 36-5002-ND; Mounting Type: TH
U3 = LMR14050SDDAR: IC REG BUCK ADJUSTABLE 5A 8SOPWR; Manufacturer 1: Texas Instruments; Output Configuration: Positive; Quiescent Current: 40uA; Supplier 1: Digi-Key; Manufacturer Part Number 1: LMR14050SDDAR; Output Type: Adjustable; Supplier Part Number 1: 296-44322-1-ND; LCSC Part #: C155484; Mounting Type: SMD; Package/Footprint: 8-PowerSOIC

## Sheet SH4 - 5V VICOR DCDC.SchDoc: 5V Vicor DCDC
size B; CheckedBy: Lance Bantoto; Engineer: Cindy Li; Organization: UW Robotics; Address1: 200 University Avenue; Address2: Waterloo; Address3: Ontario; Address4: Canada N2L 3G6; DocumentNumber: 4; Revision: 2; SheetNumber: 4; SheetTotal: 10
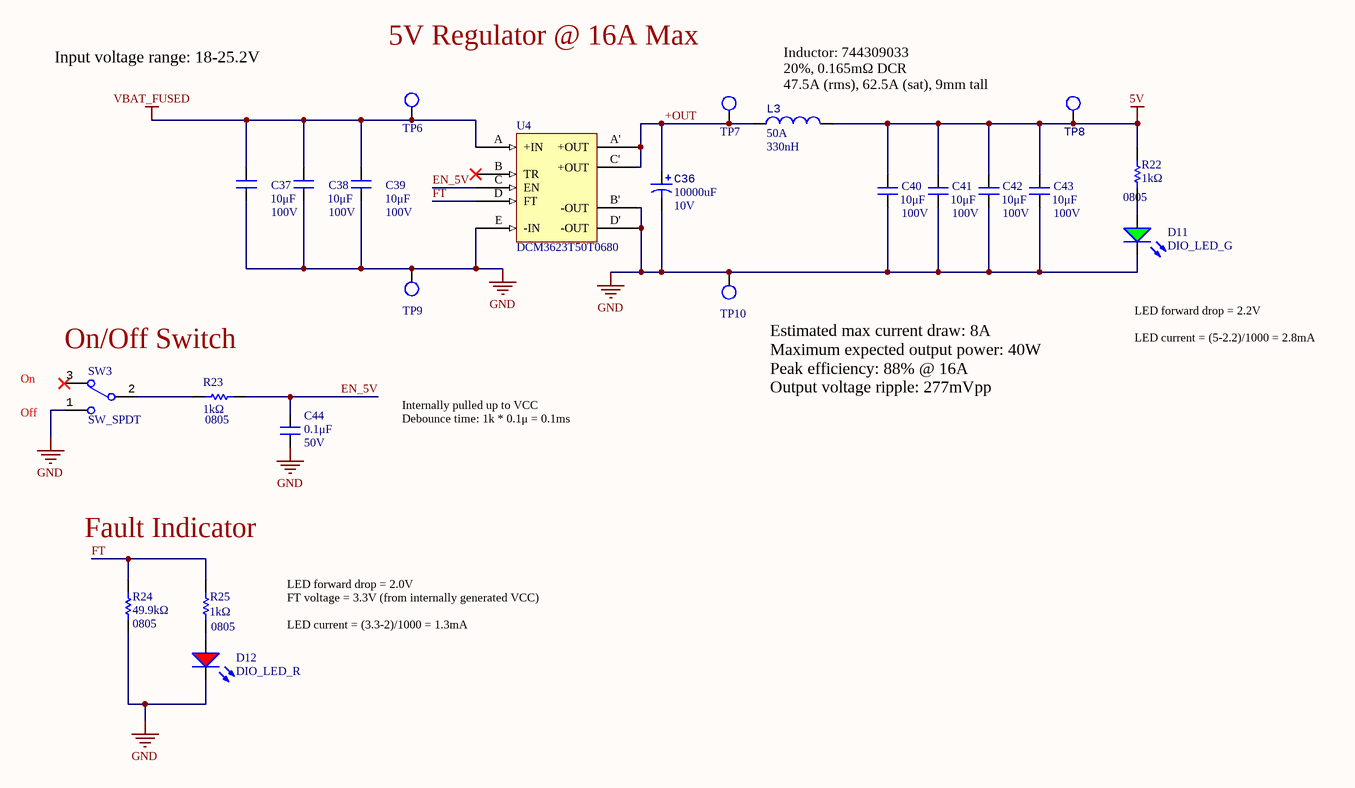
[diagram p3: SH4 - 5V VICOR DCDC.SchDoc]

### Parts
C36  Capacitance: 10000uF  Voltage Rating: 10V  [CAP_UBY_18X25_NC]  (hidden comment: URS1A103MHD1TN)
C37  value 10μF  Voltage Rating: 100V  [CAP1210]  (hidden comment: CAP_10uF_100V_1210)
C38  value 10μF  Voltage Rating: 100V  [CAP1210]  (hidden comment: CAP_10uF_100V_1210)
C39  value 10μF  Voltage Rating: 100V  [CAP1210]  (hidden comment: CAP_10uF_100V_1210)
C40  value 10μF  Voltage Rating: 100V  [CAP1210]  (hidden comment: CAP_10uF_100V_1210)
C41  value 10μF  Voltage Rating: 100V  [CAP1210]  (hidden comment: CAP_10uF_100V_1210)
C42  value 10μF  Voltage Rating: 100V  [CAP1210]  (hidden comment: CAP_10uF_100V_1210)
C43  value 10μF  Voltage Rating: 100V  [CAP1210]  (hidden comment: CAP_10uF_100V_1210)
C44  value 0.1μF  Voltage Rating: 50V  [CAP2012]  (hidden comment: CAP_0.1uF_50V_0805)
D11  DIO_LED_G  [LED_0805_GREEN]
D12  DIO_LED_R  [LED_0805_RED]
L3  Max DC Current: 50A  Inductance: 330nH  [WE-HCM 1390]  (hidden comment: 744309033)
R22  Resistance: 1kΩ  Package/Footprint: 0805  [RESC0805]  (hidden comment: RES_1kΩ_0805_1%)
R23  Resistance: 1kΩ  Package/Footprint: 0805  [RESC0805]  (hidden comment: RES_1kΩ_0805_1%)
R24  Resistance: 49.9kΩ  Package/Footprint: 0805  [RESC0805]  (hidden comment: RES_49.9kΩ_0805_1%)
R25  Resistance: 1kΩ  Package/Footprint: 0805  [RESC0805]  (hidden comment: RES_1kΩ_0805_1%)
SW3  SW_SPDT  [100SP1T1B4M2QE]
TP6  TESTPOINT_LOOP  [TESTPOINT_LOOP]  (value not drawn)
TP7  TESTPOINT_LOOP  [TESTPOINT_LOOP]  (value not drawn)
TP8  TESTPOINT_LOOP  [TESTPOINT_LOOP]  (value not drawn)
TP9  TESTPOINT_LOOP  [TESTPOINT_LOOP]  (value not drawn)
TP10  TESTPOINT_LOOP  [TESTPOINT_LOOP]  (value not drawn)
U4  DCM3623T50T0680  [DCM3623T50T0680]

### Nets
5V: C40.2 C41.2 C42.2 C43.2 L3.2 R22.2 TP8.1
GND: C36.2 C37.1 C38.1 C39.1 C40.1 C41.1 C42.1 C43.1 C44.1 D11.2(K) D12.2(K) R24.2 SW3.1 TP9.1 TP10.1 U4.B'(-OUT) U4.D'(-OUT) U4.E(-IN)
VBAT_FUSED: C37.2 C38.2 C39.2 TP6.1 U4.A(+IN)
+OUT: C36.1 L3.1 TP7.1 U4.A'(+OUT) U4.C'(+OUT)
EN_5V: C44.2 R23.2 U4.C(EN)
FT: R24.1 R25.2 U4.D(FT)
NetD11_1: D11.1(A) R22.1
NetD12_1: D12.1(A) R25.1
NetR23_1: R23.1 SW3.2

Not connected (* = marked no-connect by the designer): SW3 3*; U4 B(TR)*

### Notes on the sheet
- Input voltage range: 18-25.2V
- 5V Regulator @ 16A Max
- Inductor: 744309033
  20%, 0.165mΩ DCR
  47.5A (rms), 62.5A (sat), 9mm tall
- On
- On/Off Switch
- (near TP10) Estimated max current draw: 8A
  Maximum expected output power: 40W
  Peak efficiency: 88% @ 16A
  Output voltage ripple: 277mVpp
- LED forward drop = 2.2V
  LED current = (5-2.2)/1000 = 2.8mA
- (near SW3) Off
- Internally pulled up to VCC
  Debounce time: 1k * 0.1μ = 0.1ms
- Fault Indicator
- LED forward drop = 2.0V
  FT voltage = 3.3V (from internally generated VCC)
  LED current = (3.3-2)/1000 = 1.3mA
- Title:
- Project:
- Date:
- Rev:
- Reviewer:
- Engineer:
- Sheet:
- of

### Library data of the parts
C36 = URS1A103MHD1TN: CAP ALUM 10000UF 20% 10V RADIAL; Manufacturer 1: Nichicon; Ripple Current: 2.35A; Life (Hours): 2000Hour; Package/Footprint: TH; Supplier 1: Digi-Key; Manufacturer Part Number 1: URS1A103MHD1TN; Min Operating Temperature: -40°C; Max Operating Temperature: 85°C; Tolerance: 20%; Lead Pitch: 0.295inch; Height - Seated (Max): 1.043inch; Supplier Part Number 1: 493-12364-1-ND; Mounting Type: TH
C37-C43 = CAP_10uF_100V_1210: as C3 on sheet SH2 - 24V BUCK-BOOST CONVERTER; Supplier Part Number 1: 490-16266-1-ND; Supplier 1: Digi-Key; Dielectric: X7S; Tolerance: 10%; Mounting Type: SMD
C44 = CAP_0.1uF_50V_0805: as C17 on sheet SH2 - 24V BUCK-BOOST CONVERTER; Supplier Part Number 1: 490-8049-1-ND; Supplier 1: Digi-Key; Mount: Surface Mount; Dielectric: X7R; Length: 2mm; Height: 1.25mm; Width: 0.049inch; Thickness: 0.049inch; Depth: 1.25mm; Ratings: AEC-Q200; LCSC Part #: C49678; Mounting Type: SMD
D11 = DIO_LED_G: as D5 on sheet SH2 - 24V BUCK-BOOST CONVERTER; Supplier Part Number 1: 475-1410-1-ND; Supplier 1: Digi-Key; Mounting Type: SMD
D12 = DIO_LED_R: LED RED DIFFUSED 0805 SMD; Manufacturer Part Number 1: LS R976-NR-1; Manufacturer 1: OSRAM; Forward Voltage Drop: 2V; Package/Footprint: 0805; Supplier Part Number 1: 475-1278-1-ND; Supplier 1: Digi-Key; Mounting Type: SMD
L3 = 744309033: IND 330NH 47.5A 0.165 MOHM; Manufacturer 1: Wurth Electronics; Core Material: Zinc; Inductance Tolerance: 20%; Self Resonant Frequency: 158MHz; Saturation Current: 62.5A; Shielding: Shielded; DC Resistance (DCR): 0.165mR; Test Frequency: 100kHz; Package/Footprint: SMD; Supplier 1: Digi-Key; Manufacturer Part Number 1: 744309033; Min Operating Temperature: -40°C; Max Operating Temperature: 125°C; Current Rating: 47.5A; Tolerance: 20%; Composition: Wirewound; Termination: SMD/SMT; RMS Current (Irms): 50A; Length: 0.551inch; Height: 9mm; Width: 0.512inch; Height - Seated (Max): 0.374inch; REACH SVHC: Unknown; Supplier Part Number 1: 732-3006-1-ND; Mounting Type: SMD
R22 R23 R25 = RES_1kΩ_0805_1%: as R9 on sheet SH2 - 24V BUCK-BOOST CONVERTER; Tolerance: 1%; Supplier Part Number 1: 311-1.00KCRCT-ND; Supplier 1: Digi-Key; LCSC Part #: C17513; Mounting Type: SMD
R24 = RES_49.9kΩ_0805_1%: RES 49.9K OHM 1% 1/8W 0805; Manufacturer Part Number 1: TNPW080549K9BEEN; Manufacturer 1: Vishay Dale; Supplier 1: Digi-Key; Supplier Part Number 1: 541-3802-1-ND; Tolerance: 1%; LCSC Part #: C17719; Mounting Type: SMD
SW3 = SW_SPDT: as SW1 on sheet SH2 - 24V BUCK-BOOST CONVERTER; Supplier 1: Digi-Key; Manufacturer Part Number 1: 100SP1T1B4M2QE; Throw Configuration: SPDT; Supplier Part Number 1: EG2355-ND; Current Rating: 5A; Mounting Type: TH
TP6-TP10 = TESTPOINT_LOOP: as TP1 on sheet SH2 - 24V BUCK-BOOST CONVERTER; Supplier 1: Digi-Key; Supplier Part Number 1: 36-5002-ND; Mounting Type: TH
U4 = DCM3623T50T0680: DC DC CONVERTER 5V 80W; Manufacturer 1: Vicor Corporation; Manufacturer Part Number 1: DCM3623T50T0680T00; Package/Footprint: TH; Supplier 1: Digi-Key; Supplier Part Number 1: 1102-5585-ND; Mounting Type: TH

## Sheet SH5 - 3.3V LINEAR REGULATOR.SchDoc: 3.3V Linear Regulator
size B; CheckedBy: Lance Bantoto; Engineer: Cindy Li; Organization: UW Robotics; Address1: 200 University Avenue; Address2: Waterloo; Address3: Ontario; Address4: Canada N2L 3G6; DocumentNumber: 5; Revision: 2; SheetNumber: 5; SheetTotal: 10
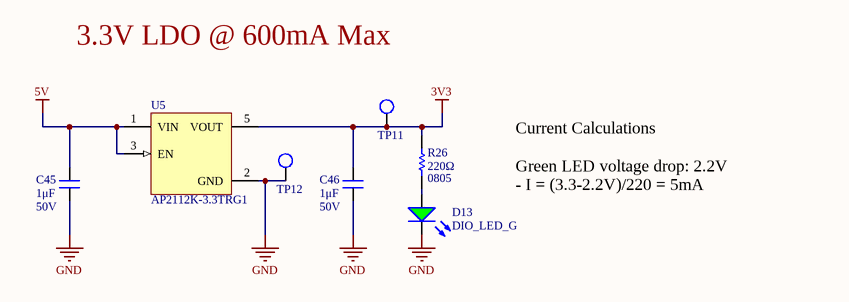
[diagram p4: SH5 - 3.3V LINEAR REGULATOR.SchDoc]

### Parts
C45  value 1μF  Voltage Rating: 50V  [CAP2012]  (hidden comment: CAP_1uF_50V_0805)
C46  value 1μF  Voltage Rating: 50V  [CAP2012]  (hidden comment: CAP_1uF_50V_0805)
D13  DIO_LED_G  [LED_0805_GREEN]
R26  value 220Ω  Package/Footprint: 0805  [RESC0805]  (hidden comment: RES_220Ω_0805_5%)
TP11  TESTPOINT_LOOP  [TESTPOINT_LOOP]  (value not drawn)
TP12  TESTPOINT_LOOP  [TESTPOINT_LOOP]  (value not drawn)
U5  Manufacturer Part Number 1: AP2112K-3.3TRG1  [SOT95P285X140-5N]  (hidden comment: LDO_3.3V_600mA)

### Nets
3V3: C46.2 R26.2 TP11.1 U5.5(VOUT)
5V: C45.2 U5.1(VIN) U5.3(EN)
GND: C45.1 C46.1 D13.2(K) TP12.1 U5.2(GND)
NetD13_1: D13.1(A) R26.1

### Notes on the sheet
- 3.3V LDO @ 600mA Max
- Current Calculations
  Green LED voltage drop: 2.2V
  - I = (3.3-2.2V)/220 = 5mA
- Title:
- Project:
- Date:
- Rev:
- Reviewer:
- Engineer:
- Sheet:
- of

### Library data of the parts
C45 C46 = CAP_1uF_50V_0805: CAP CER 1UF 50V X7R 0805; Manufacturer 1: Samsung Electro-Mechanics; Manufacturer Part Number 1: CL21B105KBFNNNG; Tolerane: ±10%; Package/Footprint: 0805; Temperature Coefficient: X7R; Supplier Part Number 1: 1276-6470-1-ND; Supplier 1: Digi-Key; LCSC Part #: C28323; Mounting Type: SMD
D13 = DIO_LED_G: as D5 on sheet SH2 - 24V BUCK-BOOST CONVERTER; Supplier Part Number 1: 475-1410-1-ND; Supplier 1: Digi-Key; Mounting Type: SMD
R26 = RES_220Ω_0805_5%: RES SMD 220 OHM 5% 1/2W 0805; Manufacturer 1: Panasonic Electronic Components; Manufacturer Part Number 1: ERJ-P06J221V; Tolerance: 5%; Supplier Part Number 1: P220ADCT-ND; Supplier 1: Digi-Key; LCSC Part #: C17557; Mounting Type: SMD
TP11 TP12 = TESTPOINT_LOOP: as TP1 on sheet SH2 - 24V BUCK-BOOST CONVERTER; Supplier 1: Digi-Key; Supplier Part Number 1: 36-5002-ND; Mounting Type: TH
U5 = LDO_3.3V_600mA: IC REG LINEAR 3.3V 600MA SOT25; Manufacturer 1: Diodes Incorporated; Input Voltage (Max): 6V; Voltage Dropout (Max): 0.4V; Package/Footprint: SOT-25; Supplier 1: Digi-Key; Supplier Part Number 1: AP2112K-3.3TRG1DICT-ND; Output Voltage (Fixed): 3.3V; Output Current: 600mA; Operating Temperature: -40°C - 85°C; LCSC Part #: C51118; Mounting Type: SMD

## Sheet SH6 - LOAD MONITORING 1.SchDoc: Load Monitoring 1
size B; CheckedBy: Lance Bantoto; Engineer: Cindy Li; Organization: UW Robotics; Address1: 200 University Avenue; Address2: Waterloo; Address3: Ontario; Address4: Canada N2L 3G6; DocumentNumber: 6; Revision: 2; SheetNumber: 6; SheetTotal: 10
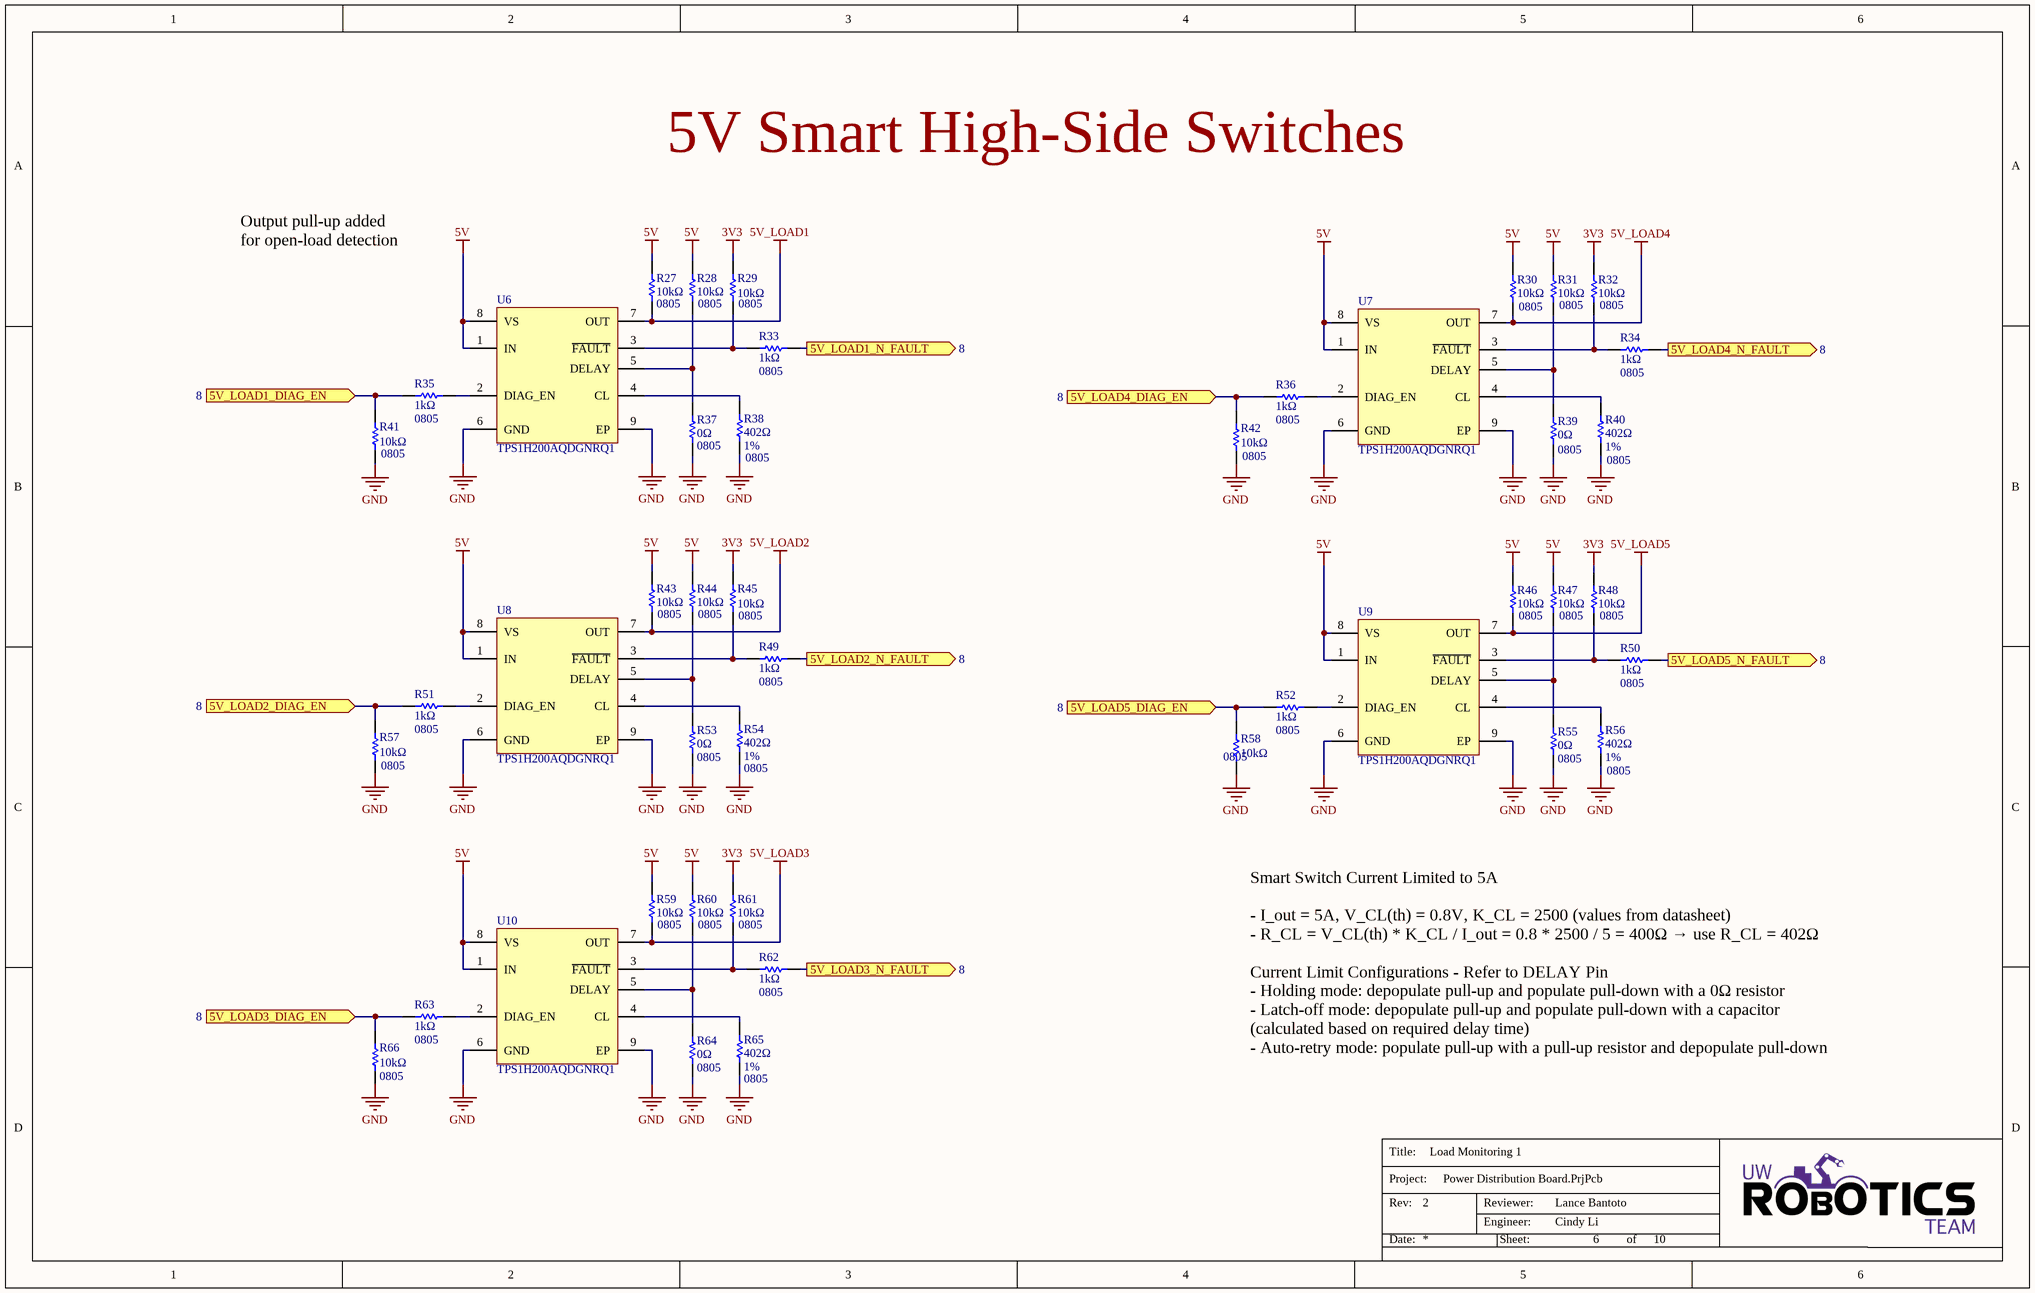
[diagram p5: SH6 - LOAD MONITORING 1.SchDoc]

### Parts
R27  value 10kΩ  Package/Footprint: 0805  [RESC0805]  (hidden comment: RES_10kΩ_0805_5%)
R28  value 10kΩ  Package/Footprint: 0805  [RESC0805]  (hidden comment: RES_10kΩ_0805_5%)
R29  value 10kΩ  Package/Footprint: 0805  [RESC0805]  (hidden comment: RES_10kΩ_0805_5%)
R30  value 10kΩ  Package/Footprint: 0805  [RESC0805]  (hidden comment: RES_10kΩ_0805_5%)
R31  value 10kΩ  Package/Footprint: 0805  [RESC0805]  (hidden comment: RES_10kΩ_0805_5%)
R32  value 10kΩ  Package/Footprint: 0805  [RESC0805]  (hidden comment: RES_10kΩ_0805_5%)
R33  Resistance: 1kΩ  Package/Footprint: 0805  [RESC0805]  (hidden comment: RES_1kΩ_0805_1%)
R34  Resistance: 1kΩ  Package/Footprint: 0805  [RESC0805]  (hidden comment: RES_1kΩ_0805_1%)
R35  Resistance: 1kΩ  Package/Footprint: 0805  [RESC0805]  (hidden comment: RES_1kΩ_0805_1%)
R36  Resistance: 1kΩ  Package/Footprint: 0805  [RESC0805]  (hidden comment: RES_1kΩ_0805_1%)
R37  value 0Ω  Package/Footprint: 0805  [RESC0805]  (hidden comment: RES_0Ω_0805)
R38  value 402Ω  Tolerance: 1%  Package/Footprint: 0805  [RESC0805]  (hidden comment: RES_402Ω_0805_1%)
R39  value 0Ω  Package/Footprint: 0805  [RESC0805]  (hidden comment: RES_0Ω_0805)
R40  value 402Ω  Tolerance: 1%  Package/Footprint: 0805  [RESC0805]  (hidden comment: RES_402Ω_0805_1%)
R41  value 10kΩ  Package/Footprint: 0805  [RESC0805]  (hidden comment: RES_10kΩ_0805_5%)
R42  value 10kΩ  Package/Footprint: 0805  [RESC0805]  (hidden comment: RES_10kΩ_0805_5%)
R43  value 10kΩ  Package/Footprint: 0805  [RESC0805]  (hidden comment: RES_10kΩ_0805_5%)
R44  value 10kΩ  Package/Footprint: 0805  [RESC0805]  (hidden comment: RES_10kΩ_0805_5%)
R45  value 10kΩ  Package/Footprint: 0805  [RESC0805]  (hidden comment: RES_10kΩ_0805_5%)
R46  value 10kΩ  Package/Footprint: 0805  [RESC0805]  (hidden comment: RES_10kΩ_0805_5%)
R47  value 10kΩ  Package/Footprint: 0805  [RESC0805]  (hidden comment: RES_10kΩ_0805_5%)
R48  value 10kΩ  Package/Footprint: 0805  [RESC0805]  (hidden comment: RES_10kΩ_0805_5%)
R49  Resistance: 1kΩ  Package/Footprint: 0805  [RESC0805]  (hidden comment: RES_1kΩ_0805_1%)
R50  Resistance: 1kΩ  Package/Footprint: 0805  [RESC0805]  (hidden comment: RES_1kΩ_0805_1%)
R51  Resistance: 1kΩ  Package/Footprint: 0805  [RESC0805]  (hidden comment: RES_1kΩ_0805_1%)
R52  Resistance: 1kΩ  Package/Footprint: 0805  [RESC0805]  (hidden comment: RES_1kΩ_0805_1%)
R53  value 0Ω  Package/Footprint: 0805  [RESC0805]  (hidden comment: RES_0Ω_0805)
R54  value 402Ω  Tolerance: 1%  Package/Footprint: 0805  [RESC0805]  (hidden comment: RES_402Ω_0805_1%)
R55  value 0Ω  Package/Footprint: 0805  [RESC0805]  (hidden comment: RES_0Ω_0805)
R56  value 402Ω  Tolerance: 1%  Package/Footprint: 0805  [RESC0805]  (hidden comment: RES_402Ω_0805_1%)
R57  value 10kΩ  Package/Footprint: 0805  [RESC0805]  (hidden comment: RES_10kΩ_0805_5%)
R58  value 10kΩ  Package/Footprint: 0805  [RESC0805]  (hidden comment: RES_10kΩ_0805_5%)
R59  value 10kΩ  Package/Footprint: 0805  [RESC0805]  (hidden comment: RES_10kΩ_0805_5%)
R60  value 10kΩ  Package/Footprint: 0805  [RESC0805]  (hidden comment: RES_10kΩ_0805_5%)
R61  value 10kΩ  Package/Footprint: 0805  [RESC0805]  (hidden comment: RES_10kΩ_0805_5%)
R62  Resistance: 1kΩ  Package/Footprint: 0805  [RESC0805]  (hidden comment: RES_1kΩ_0805_1%)
R63  Resistance: 1kΩ  Package/Footprint: 0805  [RESC0805]  (hidden comment: RES_1kΩ_0805_1%)
R64  value 0Ω  Package/Footprint: 0805  [RESC0805]  (hidden comment: RES_0Ω_0805)
R65  value 402Ω  Tolerance: 1%  Package/Footprint: 0805  [RESC0805]  (hidden comment: RES_402Ω_0805_1%)
R66  value 10kΩ  Package/Footprint: 0805  [RESC0805]  (hidden comment: RES_10kΩ_0805_5%)
U6  Manufacturer Part Number 1: TPS1H200AQDGNRQ1  [DGN0008G]  (hidden comment: TPS1H200A-Q1)
U7  Manufacturer Part Number 1: TPS1H200AQDGNRQ1  [DGN0008G]  (hidden comment: TPS1H200A-Q1)
U8  Manufacturer Part Number 1: TPS1H200AQDGNRQ1  [DGN0008G]  (hidden comment: TPS1H200A-Q1)
U9  Manufacturer Part Number 1: TPS1H200AQDGNRQ1  [DGN0008G]  (hidden comment: TPS1H200A-Q1)
U10  Manufacturer Part Number 1: TPS1H200AQDGNRQ1  [DGN0008G]  (hidden comment: TPS1H200A-Q1)

### Ports
5V_LOAD1_DIAG_EN (in, see 8), 5V_LOAD1_N_FAULT (out, see 8), 5V_LOAD2_DIAG_EN (in, see 8), 5V_LOAD2_N_FAULT (out, see 8), 5V_LOAD3_DIAG_EN (in, see 8), 5V_LOAD3_N_FAULT (out, see 8), 5V_LOAD4_DIAG_EN (in, see 8), 5V_LOAD4_N_FAULT (out, see 8), 5V_LOAD5_DIAG_EN (in, see 8), 5V_LOAD5_N_FAULT (out, see 8)

### Nets
3V3: R29.2 R32.2 R45.2 R48.2 R61.2
5V: R27.2 R28.2 R30.2 R31.2 R43.2 R44.2 R46.2 R47.2 R59.2 R60.2 U6.1(IN) U6.8(VS) U7.1(IN) U7.8(VS) U8.1(IN) U8.8(VS) U9.1(IN) U9.8(VS) U10.1(IN) U10.8(VS)
5V_LOAD1: R27.1 U6.7(OUT)
5V_LOAD2: R43.1 U8.7(OUT)
5V_LOAD3: R59.1 U10.7(OUT)
5V_LOAD4: R30.1 U7.7(OUT)
5V_LOAD5: R46.1 U9.7(OUT)
GND: R37.1 R38.1 R39.1 R40.1 R41.1 R42.1 R53.1 R54.1 R55.1 R56.1 R57.1 R58.1 R64.1 R65.1 R66.1 U6.6(GND) U6.9(EP) U7.6(GND) U7.9(EP) U8.6(GND) U8.9(EP) U9.6(GND) U9.9(EP) U10.6(GND) U10.9(EP)
NetR28_1: R28.1 R37.2 U6.5(DELAY)
NetR29_1: R29.1 R33.1 U6.3(~{FAULT})
NetR31_1: R31.1 R39.2 U7.5(DELAY)
NetR32_1: R32.1 R34.1 U7.3(~{FAULT})
NetR33_2: R33.2 ; port 5V_LOAD1_N_FAULT
NetR34_2: R34.2 ; port 5V_LOAD4_N_FAULT
NetR35_1: R35.1 R41.2 ; port 5V_LOAD1_DIAG_EN
NetR35_2: R35.2 U6.2(DIAG_EN)
NetR36_1: R36.1 R42.2 ; port 5V_LOAD4_DIAG_EN
NetR36_2: R36.2 U7.2(DIAG_EN)
NetR38_2: R38.2 U6.4(CL)
NetR40_2: R40.2 U7.4(CL)
NetR44_1: R44.1 R53.2 U8.5(DELAY)
NetR45_1: R45.1 R49.1 U8.3(~{FAULT})
NetR47_1: R47.1 R55.2 U9.5(DELAY)
NetR48_1: R48.1 R50.1 U9.3(~{FAULT})
NetR49_2: R49.2 ; port 5V_LOAD2_N_FAULT
NetR50_2: R50.2 ; port 5V_LOAD5_N_FAULT
NetR51_1: R51.1 R57.2 ; port 5V_LOAD2_DIAG_EN
NetR51_2: R51.2 U8.2(DIAG_EN)
NetR52_1: R52.1 R58.2 ; port 5V_LOAD5_DIAG_EN
NetR52_2: R52.2 U9.2(DIAG_EN)
NetR54_2: R54.2 U8.4(CL)
NetR56_2: R56.2 U9.4(CL)
NetR60_1: R60.1 R64.2 U10.5(DELAY)
NetR61_1: R61.1 R62.1 U10.3(~{FAULT})
NetR62_2: R62.2 ; port 5V_LOAD3_N_FAULT
NetR63_1: R63.1 R66.2 ; port 5V_LOAD3_DIAG_EN
NetR63_2: R63.2 U10.2(DIAG_EN)
NetR65_2: R65.2 U10.4(CL)

### Notes on the sheet
- 5V Smart High-Side Switches
- Output pull-up added for open-load detection
- Smart Switch Current Limited to 5A
  - I_out = 5A, V_CL(th) = 0.8V, K_CL = 2500 (values from datasheet)
  - R_CL = V_CL(th) * K_CL / I_out = 0.8 * 2500 / 5 = 400Ω → use R_CL = 402Ω
  Current Limit Configurations - Refer to DELAY Pin
  - Holding mode: depopulate pull-up and populate pull-down with a 0Ω resistor
  - Latch-off mode: depopulate pull-up and populate pull-down with a capacitor (calculated based on required delay time)
  - Auto-retry mode: populate pull-up with a pull-up resistor and depopulate pull-down
- Title:
- Project:
- Date:
- Rev:
- Reviewer:
- Engineer:
- Sheet:
- of

### Library data of the parts
R27-R32 R41-R48 R57-R61 R66 = RES_10kΩ_0805_5%: RES 10K OHM 5% 1/8W 0805; Manufacturer 1: Panasonic Electronic Components; Manufacturer Part Number 1: ERJ-6GEYJ103V; Supplier Part Number 1: P10KACT-ND; Supplier 1: Digi-Key; LCSC Part #: C17414; Mounting Type: SMD
R33-R36 R49-R52 R62 R63 = RES_1kΩ_0805_1%: as R9 on sheet SH2 - 24V BUCK-BOOST CONVERTER; Supplier Part Number 1: 311-1.00KCRCT-ND; Supplier 1: Digi-Key; Tolerance: 1%; LCSC Part #: C17513; Mounting Type: SMD
R37 R39 R53 R55 R64 = RES_0Ω_0805: RES 0 OHM JUMPER 1/8W 0805; Manufacturer 1: Panasonic Electronic Components; Manufacturer Part Number 1: ERJ-6GEY0R00V; Supplier Part Number 1: P0.0ACT-ND; Supplier 1: Digi-Key; LCSC Part #: C17477; Mounting Type: SMD
R38 R40 R54 R56 R65 = RES_402Ω_0805_1%: RES 402 OHM 1% 1/8W 0805; Manufacturer 1: Stackpole Electronics Inc; Manufacturer Part Number 1: RMCF0805FT402R; Supplier 1: Digi-Key; Supplier Part Number 1: RMCF0805FT402RCT-ND; LCSC Part #: C17681; Mounting Type: SMD
U6-U10 = TPS1H200A-Q1: IC PWR DRIVER N-CHAN 1:1 8MSOP; Manufacturer 1: Texas Instruments; Output Type: N-Channel; Supply Voltage: 4V - 40V; Output Current (Max): 2.5A; Rds On (Typ): 200mOhm; Package/Footprint: 8-TSSOP; Supplier 1: Digi-Key; Supplier Part Number 1: 296-50416-1-ND; Operating Temperature: 40°C - 125°C; Mounting Type: SMD